# Altium schematic sheet Mis - ICSP conector.SchDoc
size Letter
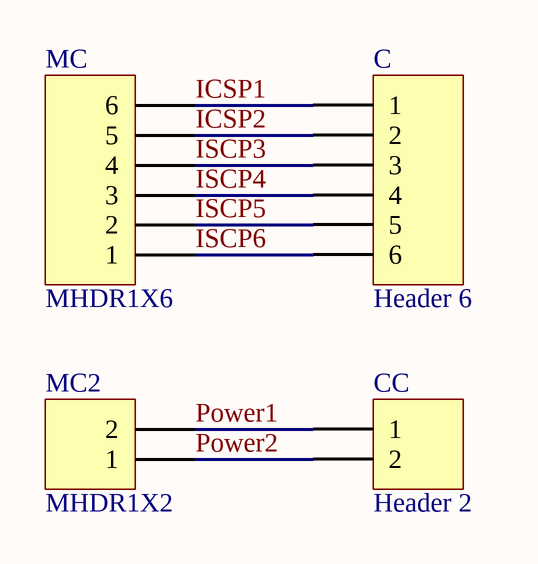
[diagram p0: Mis - ICSP conector.SchDoc]

## Parts
C  Header 6  [HDR1X6]
CC  Header 2  [HDR1X2]
MC  MHDR1X6  [MHDR1X6]
MC2  MHDR1X2  [MHDR1X2]

## Nets
ICSP1: C.1 MC.6
ICSP2: C.2 MC.5
ISCP3: C.3 MC.4
ISCP4: C.4 MC.3
ISCP5: C.5 MC.2
ISCP6: C.6 MC.1
Power1: CC.1 MC2.2
Power2: CC.2 MC2.1

## Library data of the parts
C = Header 6: Header, 6-Pin; LatestRevisionDate: 17-Jul-2002; LatestRevisionNote: Re-released for DXP Platform.; Publisher: Altium Limited
CC = Header 2: Header, 2-Pin; LatestRevisionDate: 17-Jul-2002; LatestRevisionNote: Re-released for DXP Platform.; Publisher: Altium Limited
MC = MHDR1X6: Header, 6-Pin; LatestRevisionDate: 17-Jul-2002; LatestRevisionNote: Re-released for DXP Platform.; Publisher: Altium Limited
MC2 = MHDR1X2: Header, 2-Pin; LatestRevisionDate: 17-Jul-2002; LatestRevisionNote: Re-released for DXP Platform.; Publisher: Altium Limited